# EAGLE schematic MotorDriver_v7 (EAGLE 9.7.0)
CNAME: Quad I2C Brushed Motor Driver; CREVISION: 2; DESIGNER: Arctic344
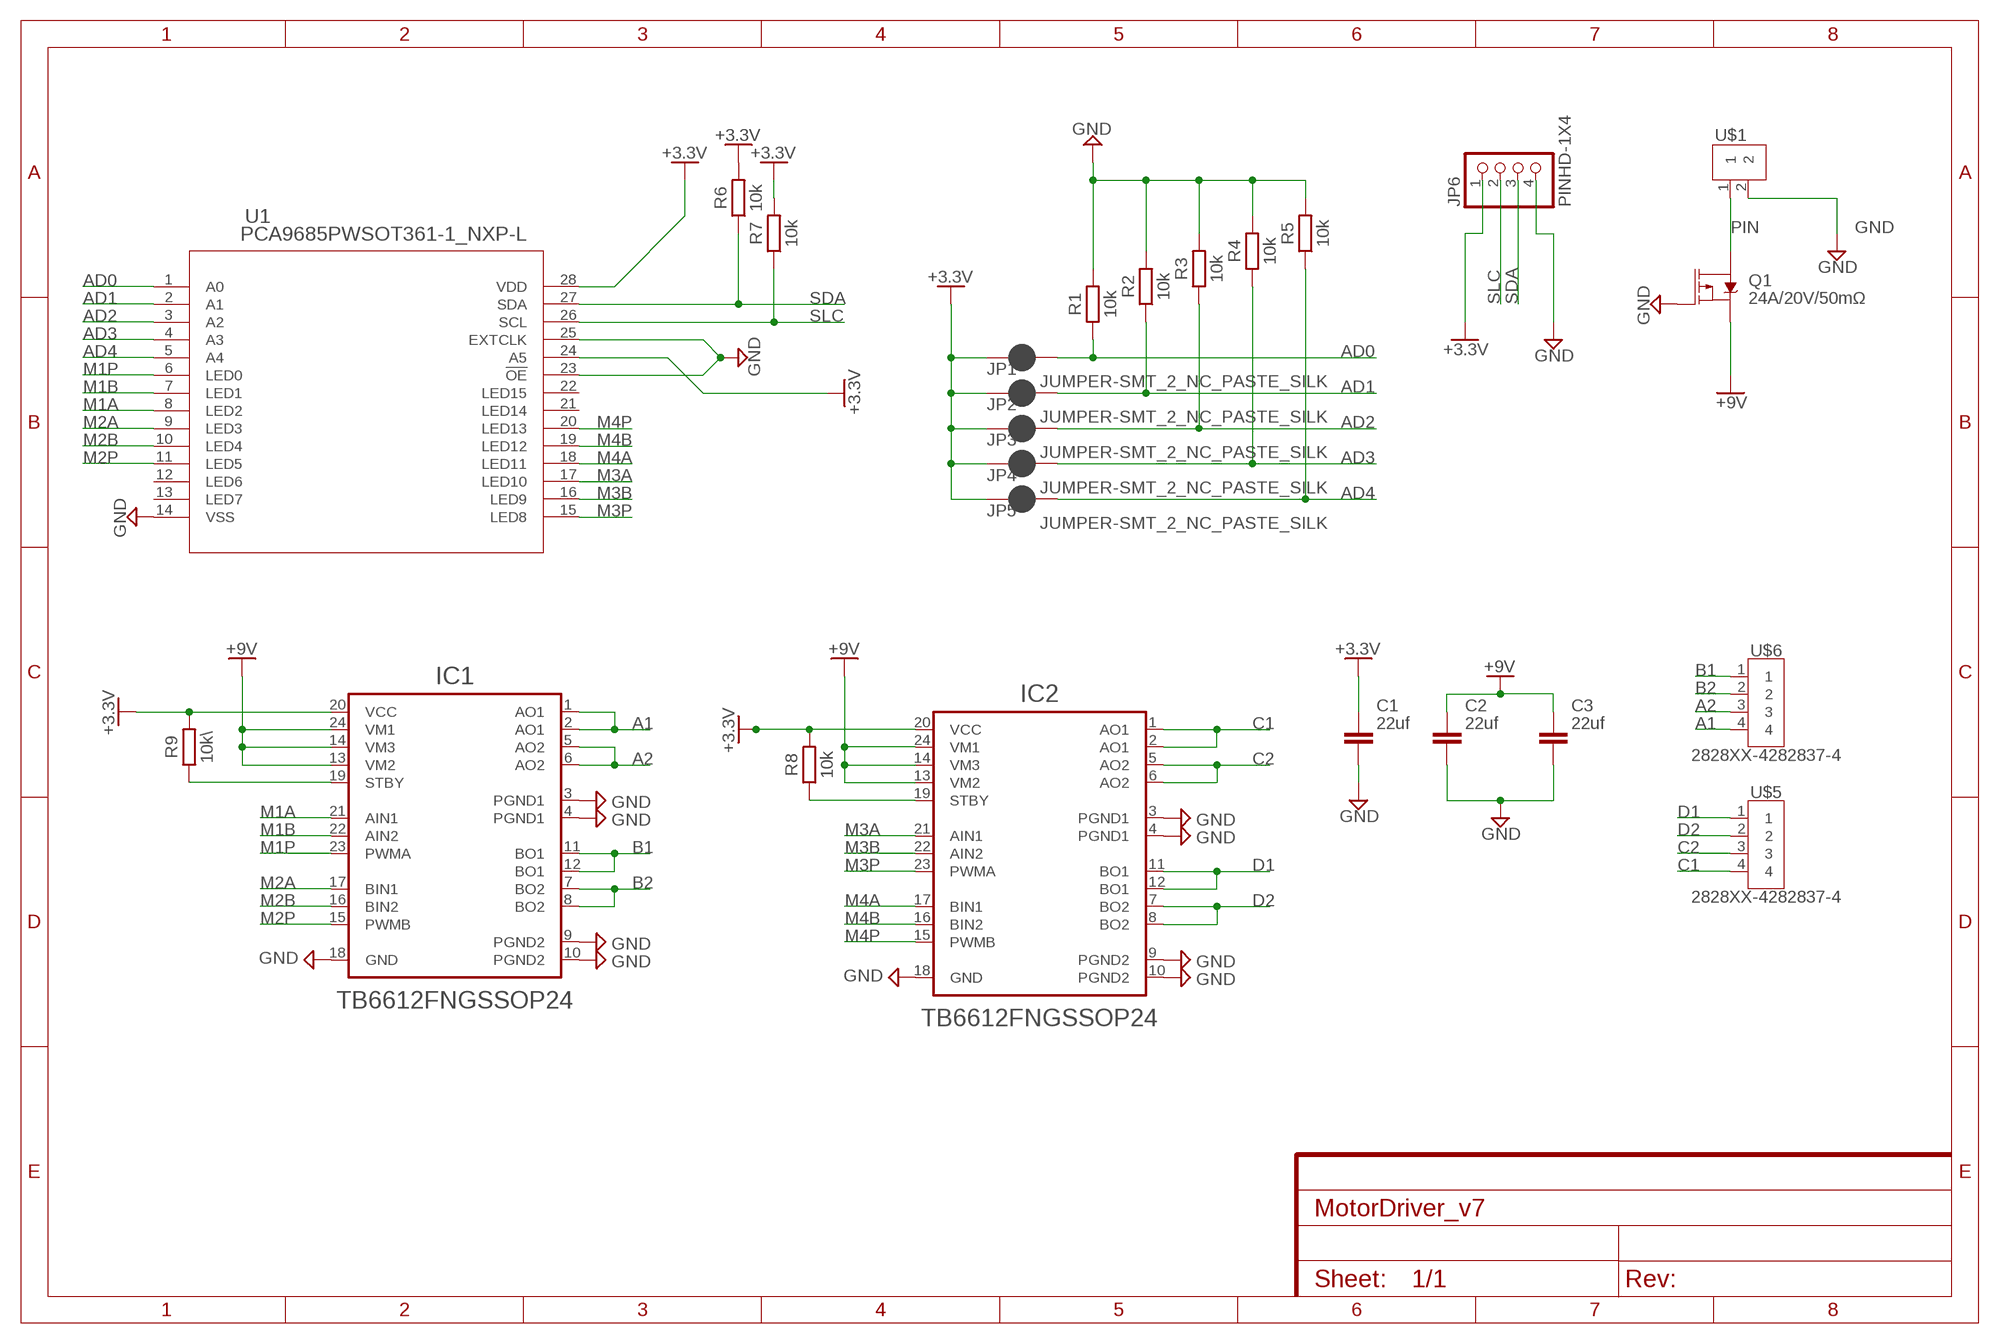
[diagram p0: schematic, sheet 1]

## Parts
C1  22uf  C_CHIP-0805(2012-METRIC)  [CAPC2012X110]
C2  22uf  C_CHIP-0805(2012-METRIC)  [CAPC2012X110]
C3  22uf  C_CHIP-0805(2012-METRIC)  [CAPC2012X110]
IC1  TB6612FNGSSOP24  [SOP65P760X160-24N]
IC2  TB6612FNGSSOP24  [SOP65P760X160-24N]
JP1  JUMPER-SMT_2_NC_PASTE_SILK  [SMT-JUMPER_2_NC_PASTE_SILK]
JP2  JUMPER-SMT_2_NC_PASTE_SILK  [SMT-JUMPER_2_NC_PASTE_SILK]
JP3  JUMPER-SMT_2_NC_PASTE_SILK  [SMT-JUMPER_2_NC_PASTE_SILK]
JP4  JUMPER-SMT_2_NC_PASTE_SILK  [SMT-JUMPER_2_NC_PASTE_SILK]
JP5  JUMPER-SMT_2_NC_PASTE_SILK  [SMT-JUMPER_2_NC_PASTE_SILK]
JP6  PINHD-1X4  [1X04]
Q1  24A/20V/50mΩ  MOSFET_PCH-NDP6020P  [TO220V]
R1  10k  R_CHIP-0402(1005-METRIC)  [RESC1005X40]
R2  10k  R_CHIP-0402(1005-METRIC)  [RESC1005X40]
R3  10k  R_CHIP-0402(1005-METRIC)  [RESC1005X40]
R4  10k  R_CHIP-0402(1005-METRIC)  [RESC1005X40]
R5  10k  R_CHIP-0402(1005-METRIC)  [RESC1005X40]
R6  10k  R_CHIP-0402(1005-METRIC)  [RESC1005X40]
R7  10k  R_CHIP-0402(1005-METRIC)  [RESC1005X40]
R8  10k  R_CHIP-0402(1005-METRIC)  [RESC1005X40]
R9  10k\  R_CHIP-0402(1005-METRIC)  [RESC1005X40]
U1  PCA9685PWSOT361-1_NXP-L  [SOT361-1_NXP-L]
U$1  2828XX-2282834-2  [TERMBLK_254-2N]
U$5  2828XX-4282837-4  [TERMBLK_508-4N]
U$6  2828XX-4282837-4  [TERMBLK_508-4N]

## Nets
+3.3V: C1.1 IC1.20(VCC) IC2.20(VCC) JP1.1 JP2.1 JP3.1 JP4.1 JP5.1 JP6.1 R6.2 R7.2 R8.2 R9.2 U1.24(A5) U1.28(VDD)
+9V: C2.1 C3.1 IC1.13(VM2) IC1.14(VM3) IC1.24(VM1) IC2.13(VM2) IC2.14(VM3) IC2.24(VM1) Q1.3(S)
A1: IC1.1(AO1) IC1.2(AO1) U$6.4
A2: IC1.5(AO2) IC1.6(AO2) U$6.3
AD0: JP1.2 R1.1 U1.1(A0)
AD1: JP2.2 R2.1 U1.2(A1)
AD2: JP3.2 R3.1 U1.3(A2)
AD3: JP4.2 R4.1 U1.4(A3)
AD4: JP5.2 R5.1 U1.5(A4)
B1: IC1.11(BO1) IC1.12(BO1) U$6.1
B2: IC1.7(BO2) IC1.8(BO2) U$6.2
C1: IC2.1(AO1) IC2.2(AO1) U$5.4
C2: IC2.5(AO2) IC2.6(AO2) U$5.3
D1: IC2.11(BO1) IC2.12(BO1) U$5.1
D2: IC2.7(BO2) IC2.8(BO2) U$5.2
GND: C1.2 C2.2 C3.2 IC1.3(PGND1) IC1.4(PGND1) IC1.9(PGND2) IC1.10(PGND2) IC1.18(GND) IC2.3(PGND1) IC2.4(PGND1) IC2.9(PGND2) IC2.10(PGND2) IC2.18(GND) JP6.4 Q1.1(G) R1.2 R2.2 R3.2 R4.2 R5.2 U1.14(VSS) U1.23(!OE) U1.25(EXTCLK) U$1.2
M1A: IC1.21(AIN1) U1.8(LED2)
M1B: IC1.22(AIN2) U1.7(LED1)
M1P: IC1.23(PWMA) U1.6(LED0)
M2A: IC1.17(BIN1) U1.9(LED3)
M2B: IC1.16(BIN2) U1.10(LED4)
M2P: IC1.15(PWMB) U1.11(LED5)
M3A: IC2.21(AIN1) U1.17(LED10)
M3B: IC2.22(AIN2) U1.16(LED9)
M3P: IC2.23(PWMA) U1.15(LED8)
M4A: IC2.17(BIN1) U1.18(LED11)
M4B: IC2.16(BIN2) U1.19(LED12)
M4P: IC2.15(PWMB) U1.20(LED13)
N$12: IC2.19(STBY) R8.1
N$15: IC1.19(STBY) R9.1
PIN: Q1.2(D) U$1.1
SDA: JP6.3 R6.1 U1.27(SDA)
SLC: JP6.2 R7.1 U1.26(SCL)
Unconnected: U1.12(LED6) U1.13(LED7) U1.21(LED14) U1.22(LED15)

## Library data of the parts
C1-C3 = Capacitor:C: Capacitor - Generic; CATEGORY: Capacitor
IC1 IC2 = IC_Power-Management:TB6612FNG: Driver IC for Dual DC motor Datasheet <https://toshiba.semicon-storage.com/info/docget.jsp?did=10660&prodName=TB6612FNG>; CATEGORY: IC_Power-Management; MANUFACTURER: Toshiba; MPN: TB6612FNG,C,8,EL; OPERATING_TEMP: -20 to +85 °C; PART_STATUS: Active; ROHS_COMPLIANT: Compliant; SUB-CATEGORY: Motor Driver; THERMALLOSS: 0.78W
JP1-JP5 = SparkFun-Jumpers:JUMPER-SMT_2_NC_PASTE: Normally closed solder jumper This jumper has an aperture in the stencil to allow solder paste to bridge the split in the wire so it's normally closed (NC). Wick off the solder to open the connection. Reapply solder to reclose the connection.
JP6 = Connector:PINHD-1X4: PIN HEADER; CATEGORY: CONNECTOR; SUB-CATEGORY: PIN-HEADER
Q1 = SparkFun-DiscreteSemi:MOSFET_PCH: P-channel MOSFETs Voltage controlled devices that allow control of high current outputs. SparkFun Products: SparkFun ESP32 Thing <https://www.sparkfun.com/products/13907> SparkFun ESP8266 Thing <https://www.sparkfun.com/products/13231>; PROD_ID: TRANS-13060
R1-R9 = Resistor:R: Resistor Fixed - Generic; CATEGORY: Resistor; SUB-CATEGORY: Fixed
U1 = 2023-07-19_03-23-06_Library:PCA9685PW; COPYRIGHT: Copyright (C) 2023 Ultra Librarian. All rights reserved.; MANUFACTURER_PART_NUMBER: PCA9685PW; MFR_NAME: NXP
U$1 = Connector:2828XX-2: 2 Position Wire to Board Terminal Block Horizontal with Board Datasheet <https://www.te.com.cn/commerce/DocumentDelivery/DDEController?Action=showdoc&DocId=Catalog+Section%7F1308389_EUROSTYLE_TERMINAL_BLOCKS%7F0607%7Fpdf%7FEnglish%7FENG_CS_1308389_EUROSTYLE_TERMINAL_BLOCKS_0607.pdf%7F2-282837-5>
U$5 U$6 = Connector:2828XX-4: 4 Position Wire to Board Terminal Block Horizontal with Board Datasheet <https://www.te.com.cn/commerce/DocumentDelivery/DDEController?Action=showdoc&DocId=Catalog+Section%7F1308389_EUROSTYLE_TERMINAL_BLOCKS%7F0607%7Fpdf%7FEnglish%7FENG_CS_1308389_EUROSTYLE_TERMINAL_BLOCKS_0607.pdf%7F2-282837-5>; CATEGORY: Connector; DESCRIPTION: TERM BLK 4P SIDE ENT 5.08mm PCB; MANUFACTURER: TE Connectivity; MPN: 282837-4; OPERATING_TEMPERATURE: 40°C to +105°C; PART_STATUS: Active; ROHS_COMPLIANCE: RoHS Compliant; SERIES: 283737; SUBCATEGORY: Terminal Block; TYPE: Side Wire Entry